# Altium schematic sheet connections.schdoc
size 209 x 297 mm; Scale: 1:1; DocumentType: Схема электрическая принципиальная; FirstReferrence: АБВГ.123456.001; PageSetup: Record=PageOptions|CenterHorizontal=False|CenterVertical=False|PrintScale=0.95|XCorrection=0.00|YCorrection=0.00|PrintKind=1|BorderSize=5000000|LeftOffset=0|BottomOffset=0|Orientation=1|PaperLength=1000|PaperWidth=1000|Scale=100|PaperSource=15|PrintQuality=600|MediaType=1|DitherType=10|PaperKind=A4|PrintScaleMode=1
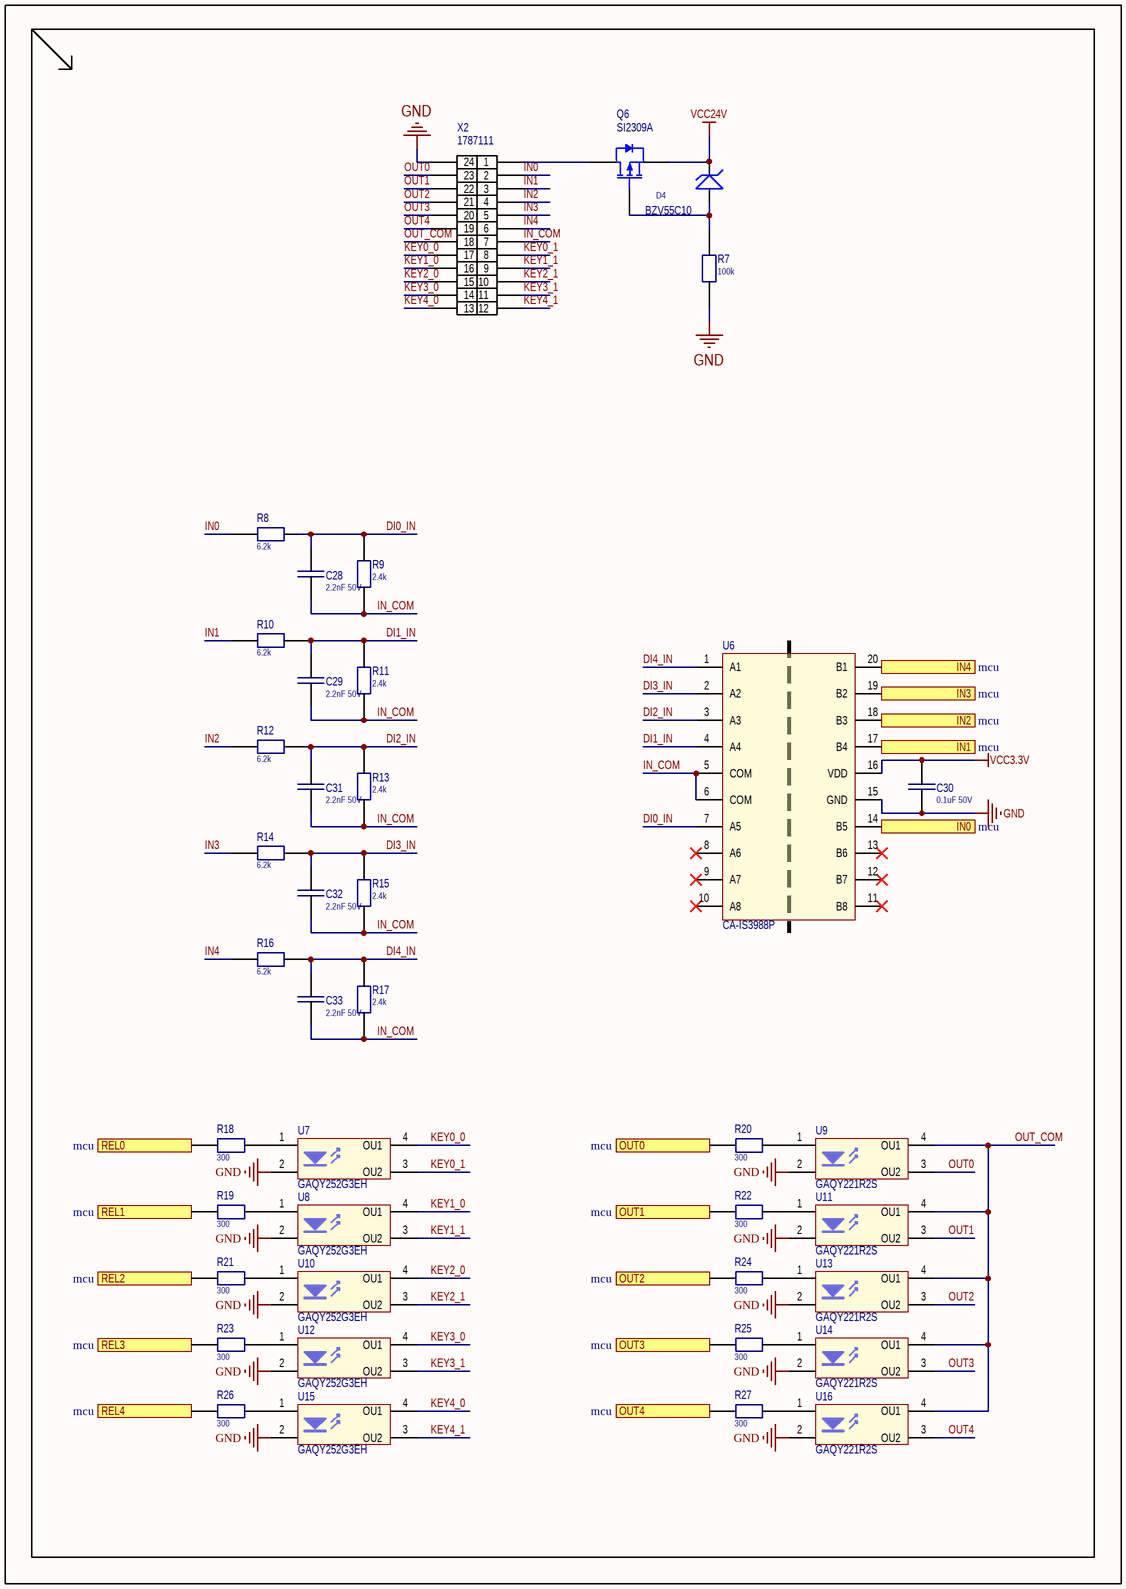
[diagram p0: connections.schdoc]

## Parts
C28  2.2nF 50V  [C_0805]
C29  2.2nF 50V  [C_0805]
C30  0.1uF 50V  [C_0603]
C31  2.2nF 50V  [C_0805]
C32  2.2nF 50V  [C_0805]
C33  2.2nF 50V  [C_0805]
D4  BZV55C10  [SOD80C]
Q6  SI2309A  [SOT23]
R7  100k  [R_0603]
R8  6.2k  [R_0805]
R9  2.4k  [R_0805]
R10  6.2k  [R_0805]
R11  2.4k  [R_0805]
R12  6.2k  [R_0805]
R13  2.4k  [R_0805]
R14  6.2k  [R_0805]
R15  2.4k  [R_0805]
R16  6.2k  [R_0805]
R17  2.4k  [R_0805]
R18  300  [R_0603]
R19  300  [R_0603]
R20  300  [R_0603]
R21  300  [R_0603]
R22  300  [R_0603]
R23  300  [R_0603]
R24  300  [R_0603]
R25  300  [R_0603]
R26  300  [R_0603]
R27  300  [R_0603]
U6  CA-IS3988P  [SOP64P600X175-20N]
U7  GAQY252G3EH  [SMD-4P]
U8  GAQY252G3EH  [SMD-4P]
U9  GAQY221R2S  [SOP254P700X270-4N]
U10  GAQY252G3EH  [SMD-4P]
U11  GAQY221R2S  [SOP254P700X270-4N]
U12  GAQY252G3EH  [SMD-4P]
U13  GAQY221R2S  [SOP254P700X270-4N]
U14  GAQY221R2S  [SOP254P700X270-4N]
U15  GAQY252G3EH  [SMD-4P]
U16  GAQY221R2S  [SOP254P700X270-4N]
X2  1787111  [DMC 1,5/12-G1F-3,5-LRP20THRR72]

## Ports
IN0 (out, see mcu), IN1 (out, see mcu), IN2 (out, see mcu), IN3 (out, see mcu), IN4 (out, see mcu), OUT0 (in, see mcu), OUT1 (in, see mcu), OUT2 (in, see mcu), OUT3 (in, see mcu), OUT4 (in, see mcu), REL0 (in, see mcu), REL1 (in, see mcu), REL2 (in, see mcu), REL3 (in, see mcu), REL4 (in, see mcu)

## Nets
GND: C30.1 R7.2 U6.15(GND) U7.2(K) U8.2(K) U9.2(K) U10.2(K) U11.2(K) U12.2(K) U13.2(K) U14.2(K) U15.2(K) U16.2(K) X2.24
VCC3.3V: C30.2 U6.16(VDD)
VCC24V: D4.2(K) Q6.2(S)
DI0_IN: C28.2 R8.2 R9.2 U6.7(A5)
DI1_IN: C29.2 R10.2 R11.2 U6.4(A4)
DI2_IN: C31.2 R12.2 R13.2 U6.3(A3)
DI3_IN: C32.2 R14.2 R15.2 U6.2(A2)
DI4_IN: C33.2 R16.2 R17.2 U6.1(A1)
IN0: R8.1 X2.2
IN0: U6.14(B5) ; port IN0  [a separate net that carries the same name]
IN1: R10.1 X2.3
IN1: U6.17(B4) ; port IN1  [a separate net that carries the same name]
IN2: R12.1 X2.4
IN2: U6.18(B3) ; port IN2  [a separate net that carries the same name]
IN3: R14.1 X2.5
IN3: U6.19(B2) ; port IN3  [a separate net that carries the same name]
IN4: R16.1 X2.6
IN4: U6.20(B1) ; port IN4  [a separate net that carries the same name]
IN_COM: C28.1 C29.1 C31.1 C32.1 C33.1 R9.1 R11.1 R13.1 R15.1 R17.1 U6.5(COM) U6.6(COM) X2.7
KEY0_0: U7.4(OU1) X2.17
KEY0_1: U7.3(OU2) X2.8
KEY1_0: U8.4(OU1) X2.16
KEY1_1: U8.3(OU2) X2.9
KEY2_0: U10.4(OU1) X2.15
KEY2_1: U10.3(OU2) X2.10
KEY3_0: U12.4(OU1) X2.14
KEY3_1: U12.3(OU2) X2.11
KEY4_0: U15.4(OU1) X2.13
KEY4_1: U15.3(OU2) X2.12
OUT0: U9.3(OU2) X2.23
OUT0: R20.2 ; port OUT0  [a separate net that carries the same name]
OUT1: U11.3(OU2) X2.22
OUT1: R22.2 ; port OUT1  [a separate net that carries the same name]
OUT2: U13.3(OU2) X2.21
OUT2: R24.2 ; port OUT2  [a separate net that carries the same name]
OUT3: U14.3(OU2) X2.20
OUT3: R25.2 ; port OUT3  [a separate net that carries the same name]
OUT4: U16.3(OU2) X2.19
OUT4: R27.2 ; port OUT4  [a separate net that carries the same name]
OUT_COM: U9.4(OU1) U11.4(OU1) U13.4(OU1) U14.4(OU1) U16.4(OU1) X2.18
REL0: R18.2 ; port REL0
REL1: R19.2 ; port REL1
REL2: R21.2 ; port REL2
REL3: R23.2 ; port REL3
REL4: R26.2 ; port REL4
NetD4_1: D4.1(A) Q6.1(G) R7.1
NetQ6_3: Q6.3(D) X2.1
NetR18_1: R18.1 U7.1(A)
NetR19_1: R19.1 U8.1(A)
NetR20_1: R20.1 U9.1(A)
NetR21_1: R21.1 U10.1(A)
NetR22_1: R22.1 U11.1(A)
NetR23_1: R23.1 U12.1(A)
NetR24_1: R24.1 U13.1(A)
NetR25_1: R25.1 U14.1(A)
NetR26_1: R26.1 U15.1(A)
NetR27_1: R27.1 U16.1(A)

Not connected (* = marked no-connect by the designer): U6 8(A6)* 9(A7)* 10(A8)* 11(B8)* 12(B7)* 13(B6)*

## Library data of the parts
C28 C29 C31-C33 = C0805: Capacitor; Part: CC0805KRX7R9BB222; Alternative Part: CL21B222KBANNNC; Value: 2.2nF 50V; JLCPCB Part: C107146
C30 = C0603: Capacitor; Part: CC0603KPX7R9BB104; Value: 0.1uF 50V; JLCPCB Part: C14663
D4 = DZ_SOD80: Diode; Part: BZV55C10; JLCPCB Part: C545361
Q6 = P-ch_SOT23: P-Channel MOSFET; Part: SI2309A; JLCPCB Part: C2681220
R7 = RES_SMD: Resistor; Part: RC0603JR-07100KL; Alternative Part: *; Value: 100k; JLCPCB Part: C100048
R8 R10 R12 R14 R16 = R0805: Resistor; Part: RC0805JR-076K2L; Alternative Part: CR-05JL7-6K2; Value: 6.2k; JLCPCB Part: C114535
R9 R11 R13 R15 R17 = R0805: Resistor; Part: RC0805JR-072K4L; Alternative Part: CR-05JL7-2K4; Value: 2.4k; JLCPCB Part: C114236
R18-R27 = R0603: Resistor; Part: RC0603FR-07300RL; Value: 300; JLCPCB Part: C114617
U6 = CA-IS3988P: Isolated Octal Industrial Digital Input; Part: CA-IS3988P; JLCPCB Part: C5210911
U7 U8 U10 U12 U15 = GAQY252G3EH: Solid State Relay 60V 3A; Part: GAQY252G3EH; JLCPCB Part: C7435131
U9 U11 U13 U14 U16 = KAQY212S: Solid State Relay 60V 250mA; Part: GAQY221R2S; JLCPCB Part: C22385176
X2 = DMC 1,5/12-G1F-3,5-LRP20THRR72 / 1706067: THR-3.5-24P; Part: 1787111; JLCPCB Part: 1787111